# Altium schematic sheet PCB_EnergyMonitor.SchDoc
size A4
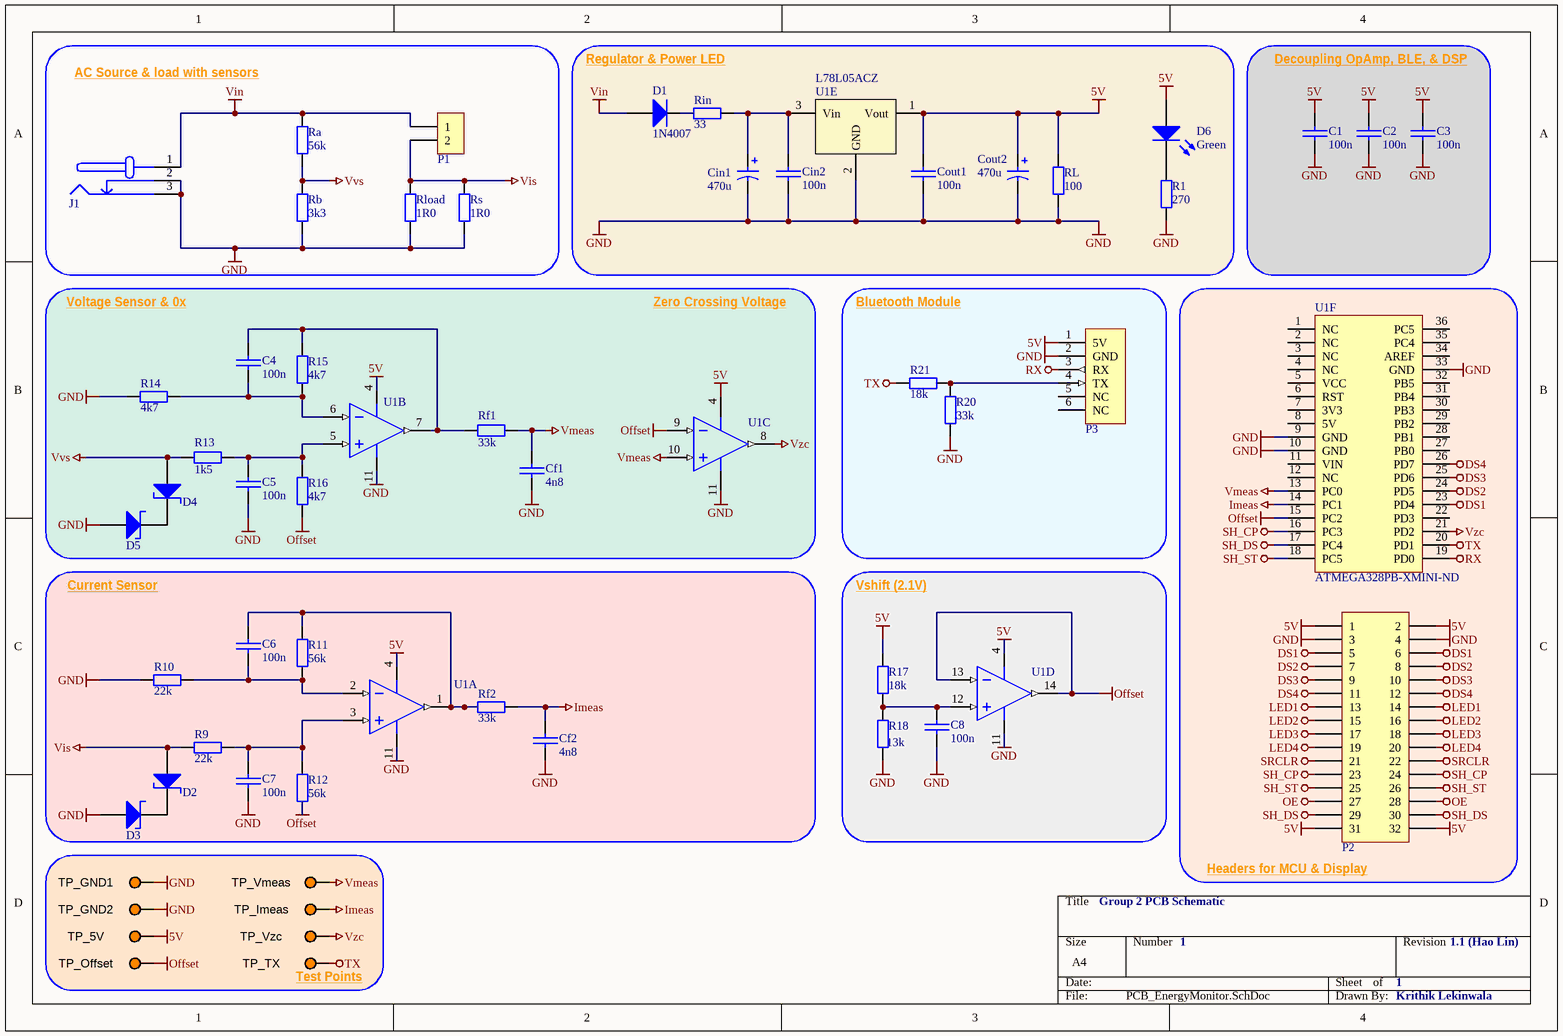
[diagram p0: PCB_EnergyMonitor.SchDoc]

## Parts
C1  100n  [CCAP-5P0]
C2  100n  [CCAP-5P0]
C3  100n  [CCAP-5P0]
C4  100n  [CCAP-5P0]
C5  100n  [CCAP-5P0]
C6  100n  [CCAP-5P0]
C7  100n  [CCAP-5P0]
C8  100n  [CCAP-5P0]
Cf1  4n8  [CCAP-5P0]
Cf2  4n8  [CCAP-5P0]
Cin1  470u  [CAP-RAD-2.5mm Pitch]
Cin2  100n  [CCAP-5P0]
Cout1  100n  [CCAP-5P0]
Cout2  470u  [CAP-RAD-2.5mm Pitch]
D1  1N4007  [1N4007-MFG]
D2  BZX79-CXVX  [AXIAL-Zener-0.4]  (value not drawn)
D3  BZX79-CXVX  [AXIAL-Zener-0.4]  (value not drawn)
D4  BZX79-CXVX  [AXIAL-Zener-0.4]  (value not drawn)
D5  BZX79-CXVX  [AXIAL-Zener-0.4]  (value not drawn)
D6  Green  [LED]
J1  DC barrel jack  [AC-Socket]  (value not drawn)
P1  Dual Banana Plugs  [Dual Banana Plug]  (value not drawn)
P2  Display  [Display]  (value not drawn)
P3  BLE Module Header  [HM10_HDR1X6]  (value not drawn)
R1  270  [AXIAL-0.4]
R9  22k  [AXIAL-0.4]
R10  22k  [AXIAL-0.4]
R11  56k  [AXIAL-0.4]
R12  56k  [AXIAL-0.4]
R13  1k5  [AXIAL-0.4]
R14  4k7  [AXIAL-0.4]
R15  4k7  [AXIAL-0.4]
R16  4k7  [AXIAL-0.4]
R17  18k  [AXIAL-0.4]
R18  13k  [AXIAL-0.4]
R20  33k  [AXIAL-0.4]
R21  18k  [AXIAL-0.4]
Ra  56k  [AXIAL-0.4]
Rb  3k3  [AXIAL-0.4]
Rf1  33k  [AXIAL-0.4]
Rf2  33k  [AXIAL-0.4]
Rin  33  [AXIAL-0.4]
RL  100  [AXIAL-0.4]
Rload  1R0  [AXIAL-0.4]
Rs  1R0  [AXIAL-0.4]
TP_5V  5003  [TP_TH]  (value not drawn)
TP_GND1  5003  [TP_TH]  (value not drawn)
TP_GND2  5003  [TP_TH]  (value not drawn)
TP_Imeas  5003  [TP_TH]  (value not drawn)
TP_Offset  5003  [TP_TH]  (value not drawn)
TP_TX  5003  [TP_TH]  (value not drawn)
TP_Vmeas  5003  [TP_TH]  (value not drawn)
TP_Vzc  5003  [TP_TH]  (value not drawn)
U1  LM324  [DIP-14]  (value not drawn)  (parts A,B,C,D of 4)
U1E  L78L05ACZ  [TO-92]
U1F  Supplier Part Number 1: ATMEGA328PB-XMINI-ND  [ATmeg328P Xplained]  (hidden comment: ATmega328PB Xplained Mini Header)

## Blocks framed on the sheet
AC Source & load with sensors: J1 P1 Ra Rb Rload Rs
Regulator & Power LED: Cin1 Cin2 Cout1 Cout2 D1 D6 R1 Rin RL U1E
Decoupling OpAmp, BLE, & DSP: C1-C3
Bluetooth Module: P3 R20 R21
Headers for MCU & Display: P2 U1F
Current Sensor: C6 C7 Cf2 D2 D3 R9-R12 Rf2 U1
Vshift (2.1V): C8 R17 R18 U1
Test Points: TP_5V TP_GND1 TP_GND2 TP_Imeas TP_Offset TP_TX TP_Vmeas TP_Vzc

## Nets
5V: C1.1 C2.1 C3.1 Cout1.1 Cout2.1 D6.1(A) P2.1 P2.2 P2.31 P2.32 P3.1(5V) R17.2 RL.2 TP_5V.1 U1.4(VDD) U1E.1(Vout)
DS1: P2.5 P2.6 U1F.23(PD4)
DS2: P2.7 P2.8 U1F.24(PD5)
DS3: P2.9 P2.10 U1F.25(PD6)
DS4: P2.11 P2.12 U1F.26(PD7)
GND: C1.2 C2.2 C3.2 C5.2 C7.2 C8.2 Cf1.2 Cf2.2 Cin1.2 Cin2.2 Cout1.2 Cout2.2 D3.1(A) D5.1(A) J1.2(GND_ALT) J1.3(GND) P2.3 P2.4 P3.2(GND) R1.1 R10.1 R14.1 R18.1 R20.1 Rb.1 RL.1 Rload.1 Rs.2 TP_GND1.1 TP_GND2.1 U1.11(VSS) U1E.2(GND) U1F.9(GND) U1F.10(GND) U1F.33(GND)
Imeas: Cf2.1 Rf2.2 TP_Imeas.1 U1F.14(PC1)
LED1: P2.13 P2.14
LED2: P2.15 P2.16
LED3: P2.17 P2.18
LED4: P2.19 P2.20
OE: P2.27 P2.28
Offset: R12.1 R16.1 TP_Offset.1 U1.9(VINC-) U1.13(VIND-) U1.14(VOUTD) U1F.15(PC2)
RX: P3.3(RX) U1F.19(PD0)
SH_CP: P2.23 P2.24 U1F.16(PC3)
SH_DS: P2.29 P2.30 U1F.17(PC4)
SH_ST: P2.25 P2.26 U1F.18(PC5)
SRCLR: P2.21 P2.22
TX: R21.2 TP_TX.1 U1F.20(PD1)
Vin: D1.1(A) J1.1(VCC) P1.1 Ra.2
Vis: D2.1(A) P1.2 R9.1 Rload.2 Rs.1
Vmeas: Cf1.1 Rf1.2 TP_Vmeas.1 U1.10(VINC+) U1F.13(PC0)
Vvs: D4.1(A) R13.1 Ra.1 Rb.2
Vzc: TP_Vzc.1 U1.8(VOUTC) U1F.21(PD2)
NetC4_1: C4.1 R15.2 Rf1.1 U1.7(VOUTB)
NetC4_2: C4.2 R14.2 R15.1 U1.6(VINB-)
NetC5_1: C5.1 R13.2 R16.2 U1.5(VINB+)
NetC6_1: C6.1 R11.2 Rf2.1 U1.1(VOUTA)
NetC6_2: C6.2 R10.2 R11.1 U1.2(VINA-)
NetC7_1: C7.1 R9.2 R12.2 U1.3(VINA+)
NetC8_1: C8.1 R17.1 R18.2 U1.12(VIND+)
NetCin1_1: Cin1.1 Cin2.1 Rin.2 U1E.3(Vin)
NetD1_2: D1.2(K) Rin.1
NetD2_2: D2.2(K) D3.2(K)
NetD4_2: D4.2(K) D5.2(K)
NetD6_2: D6.2(K) R1.2
NetP3_4: P3.4(TX) R20.2 R21.1

Not connected (* = marked no-connect by the designer): P3 5(NC) 6(NC); U1F 1(NC) 2(NC) 3(NC) 4(NC) 5(VCC) 6(RST) 7(3V3) 8(5V) 11(VIN) 12(NC) 22(PD3) 27(PB0) 28(PB1) 29(PB2) 30(PB3) 31(PB4) 32(PB5) 34(AREF) 35(PC4) 36(PC5)

## Notes on the sheet
- Voltage Sensor & 0x
- Zero Crossing Voltage
- Group 2 PCB Schematic
- 1
- 1.1 (Hao Lin)
- Krithik Lekinwala
- Labels drawn without touching a wire or pin: 5V, GND

## Library data of the parts
C1-C8 Cf1 Cf2 Cin2 Cout1 = CerCap_TH_5P0: SMT ceramic capacitor 0805 size
  C1-C8 Cin2 Cout1: Value: 100n
  Cf1 Cf2: Value: 4n8
Cin1 Cout2 = ElecCap_TH_2P0: Electrolytic capacitor with radial package, 2mm pitch and 5.2mm diameter; Published: 8-Jun-2000; LatestRevisionDate: 17-Jul-2002; LatestRevisionNote: Re-released for DXP Platform.; PackageReference: POLAR0.8; Publisher: Altium Limited; PackageDescription: Polarized Capacitor; 2 Leads; Value: 470u
D1 = 1N4007_TH_4AX0: 1N4007 1000V standard axial diode; ComponentLink1URL: https://www.fairchildsemi.com/datasheets/1N/1N914.pdf; ComponentLink1Description: https://www.fairchildsemi.com/datasheets/1N/1N914.pdf; Supplier 1: Digi-Key; Supplier Part Number 1: 1N4007RLGOSCT-ND
D2-D5 = Zener_TH_4AX0: Axial zener diode BZX79 series; Manufacturer: Nexperia USA Inc.; Manufacturer Part Number: BZX79-C4V7,143; Tolerance: ±5%; Supplier 1: Digi-Key; RoHS: RoHS Compliant; Category: Discrete Semiconductor Products; Stock 1: 8933; Pricing 1: 1=0.23, 10=0.206, 100=0.1123, 500=0.06912, 1000=0.04714 (NZD); Packaging: Cut Tape (CT); Part Status: Active; Operating Temperature: -65°C ~ 200°C; Mounting Type: Through Hole; Package / Case: DO-204AH, DO-35, Axial; Supplier Device Package: DO-35; ComponentLink1URL: https://assets.nexperia.com/documents/data-sheet/BZX79.pdf; ComponentLink1Description: https://assets.nexperia.com/documents/data-sheet/BZX79.pdf; Supplier Part Number 1: 1727-1864-1-ND
D6 = LED_TH_2P54: Typical throughole GaAs LED with 2.54mm pitch; Manufacturer: Generic Components; Class I: Optoelectronic; Published: 8-Jun-2000; Revision: July-2002: Re-released for DXP Platform.; Publisher: Altium Limited; Class II: LED; Value: Green
J1 = AC_Input: DC barrel jack connection to AC source; Value: socket
P1 = AC_Output: Dual banana plugs connection to the AC load; LatestRevisionDate: 17-Jul-2002; LatestRevisionNote: Re-released for DXP Platform.; Publisher: Altium Limited
P2 = Display: 16-Pin Header Connecting Display
P3 = BLEModule_TH: 2.54mm pitch 6-pin header for BLE module; LatestRevisionDate: 17-Jul-2002; LatestRevisionNote: Re-released for DXP Platform.; Publisher: Altium Limited
R1 R9-R18 R20 R21 Ra Rb Rf1 Rf2 Rin RL Rload Rs = Res_TH_0AX4: Through hole resistor; Published: 8-Jun-2000; LatestRevisionDate: 17-Jul-2002; LatestRevisionNote: Re-released for DXP Platform.; PackageReference: AXIAL-0.4; Publisher: Altium Limited; ComponentLink1Description: http://www.royalohm.com/pdf/product2017/PrecisionMetalMF.pdf
  R1: Value: 270
  R9 R10: Value: 22k
  R11 R12 Ra: Value: 56k
  R13: Value: 1k5
  R14-R16: Value: 4k7
  R17 R21: Value: 18k
  R18: Value: 13k
  R20 Rf1 Rf2: Value: 33k
  Rb: Value: 3k3
  Rin: Value: 33
  RL: Value: 100
  Rload Rs: Value: 1R0
TP_5V TP_GND1 TP_GND2 TP_Imeas TP_Offset TP_TX TP_Vmeas TP_Vzc = TestPoint: Test Point, Orange, 1-Pin THD, RoHS; Peak Reverse Current: 600 uA; Forward Current: 3 A; Max Surge Current: 80 A; Forward Voltage: 1.08 V; Max Operating Temperature: 150 degC; PackageReference: 5003; Pins: 2; ComponentLink2URL: http://keyelco.com/userAssets/file/M65p56.pdf; PackageDescription: 1-Pin Through Hole Device, Dia 2.54 mm; Weight: 0.01 lb; Diameter: 5.3 mm; Mount: Through Hole; Package Quantity: 500; Packaging: Bulk; Min Operating Temperature: -65 degC; ComponentLink1Description: Manufacturer URL; Height: 0.25 inch; ComponentLink1URL: http://www.keyelco.com/; ComponentLink2Description: Datasheet; Width: 0.25 inch; REACH SVHC: No SVHC; RoHSCompliant: true; Radiation Hardening: No; Length: 9.5 mm; DatasheetVersion: Jun-15
U1 = LM324N_TH_DIP16: IC OPAMP GP 14DIP; Manufacturer: ON Semiconductor; Manufacturer Part Number: LM324N; Amplifier Type: General Purpose; Current - Supply: 1mA; Voltage - Supply, Single/Dual (±): 3 V ~ 32 V, ±1.5 V ~ 16 V; Supplier 1: Digi-Key; RoHS: RoHS Compliant; Category: Integrated Circuits (ICs); Stock 1: 2900; Pricing 1: 1=0.9, 10=0.775, 100=0.5789, 500=0.45482, 1000=0.35145 (NZD); Packaging: Tube; Part Status: Active; Output Type: -; Slew Rate: -; Operating Temperature: 0°C ~ 70°C; Mounting Type: Through Hole; Package / Case: 14-DIP (0.300", 7.62mm); Supplier Device Package: 14-DIP; Base Part Number: LM324; ComponentLink1URL: https://www.fairchildsemi.com/datasheets/LM/LM2902.pdf; ComponentLink1Description: https://www.fairchildsemi.com/datasheets/LM/LM2902.pdf; Supplier Part Number 1: LM324NFS-ND
U1E = L78L05_TH_TO92: Voltage Regulator 5V; Manufacturer: ON Semiconductor; Manufacturer Part Number: LM78L05ACZX; Output Configuration: Positive; Output Type: Fixed; Voltage - Input (Max): 30V; Current - Output: 100mA; PSRR: 80dB (120Hz); Protection Features: Over Temperature, Short Circuit; Supplier 1: Digi-Key; RoHS: RoHS Compliant; Category: Integrated Circuits (ICs); Stock 1: 7782; Pricing 1: 1=0.69, 10=0.517, 100=0.3226, 500=0.2207, 1000=0.16976 (NZD); Packaging: Cut Tape (CT); Part Status: Active; Voltage - Output (Min/Fixed): 5V; Voltage - Output (Max): -; Voltage Dropout (Max): -; Control Features: -; Operating Temperature: -40°C ~ 125°C; Mounting Type: Through Hole; Package / Case: TO-226-3, TO-92-3 (TO-226AA) (Formed Leads); Supplier Device Package: TO-92-3; Base Part Number: LM78L05; ComponentLink1URL: https://www.fairchildsemi.com/datasheets/MC/MC78L05A.pdf; ComponentLink1Description: https://www.fairchildsemi.com/datasheets/MC/MC78L05A.pdf; Supplier Part Number 1: LM78L05ACZXCT-ND
U1F = ATmega328PBXplained_TH: Dual 18-pin headers connecting to ATmega328PB Xplained Mini; Manufacturer: Microchip Technology; Manufacturer Part Number: ATMEGA328PB-XMINI; Board Type: Evaluation Platform; Core Processor: AVR; Platform: ATmega328P Xplained Mini; Contents: Board(s); Supplier 1: Digi-Key; RoHS: RoHS Compliant; Category: Development Boards, Kits, Programmers; Stock 1: 454; Pricing 1: 1=15.11 (NZD); Part Status: Active; Type: MCU 8-Bit; Operating System: -; For Use With/Related Products: ATmega328P; Mounting Type: Fixed; ComponentLink1URL: http://www.microchip.com/mymicrochip/filehandler.aspx?ddocname=en589665; ComponentLink1Description: http://www.microchip.com/mymicrochip/filehandler.aspx?ddocname=en589665